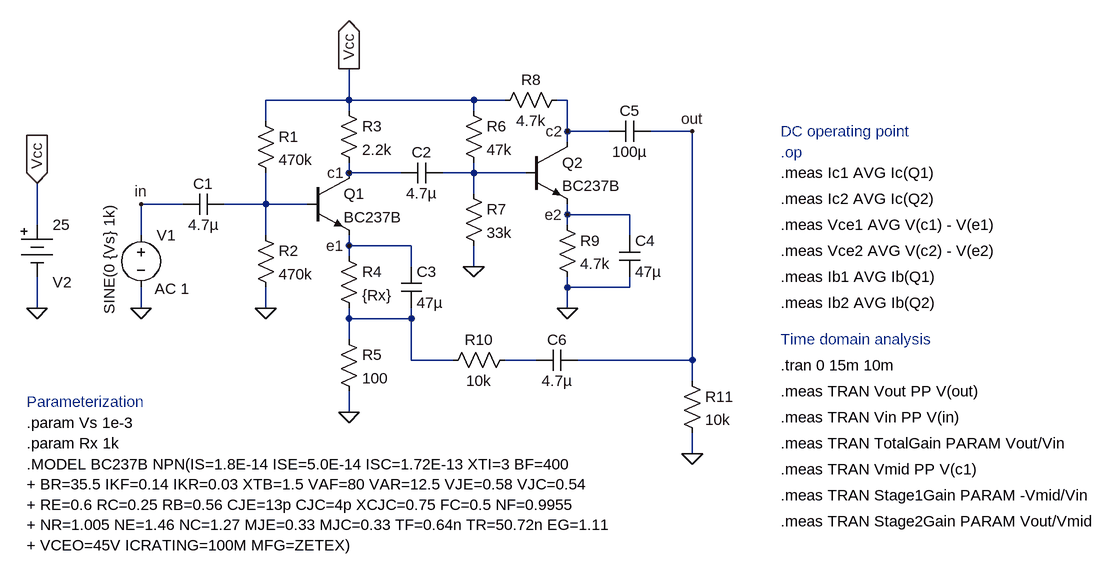
[diagram p0: schematic exp1.asc]
exp1.asc, the LTspice schematic file:
Version 4.1
SHEET 1 3584 680
WIRE 240 -80 240 -128
WIRE 240 -80 112 -80
WIRE 432 -80 240 -80
WIRE 480 -80 432 -80
WIRE 576 -80 560 -80
WIRE 240 -64 240 -80
WIRE 432 -64 432 -80
WIRE 112 -48 112 -80
WIRE 576 -32 576 -80
WIRE 640 -32 576 -32
WIRE 768 -32 704 -32
WIRE 576 -16 576 -32
WIRE 240 32 240 16
WIRE 320 32 240 32
WIRE 432 32 432 16
WIRE 432 32 384 32
WIRE 512 32 432 32
WIRE 432 64 432 32
WIRE -16 80 -80 80
WIRE 112 80 112 32
WIRE 112 80 48 80
WIRE 176 80 112 80
WIRE 576 96 576 80
WIRE 672 96 576 96
WIRE -240 112 -240 48
WIRE 576 112 576 96
WIRE -80 128 -80 80
WIRE 112 128 112 80
WIRE 672 128 672 96
WIRE 240 144 240 128
WIRE 336 144 240 144
WIRE 240 160 240 144
WIRE 336 176 336 144
WIRE 432 176 432 144
WIRE 576 208 576 192
WIRE 672 208 672 192
WIRE 672 208 576 208
WIRE -240 240 -240 192
WIRE -80 240 -80 208
WIRE 112 240 112 208
WIRE 576 240 576 208
WIRE 240 256 240 240
WIRE 336 256 336 240
WIRE 336 256 240 256
WIRE 240 288 240 256
WIRE 336 320 336 256
WIRE 400 320 336 320
WIRE 528 320 480 320
WIRE 768 320 768 -32
WIRE 768 320 592 320
WIRE 768 352 768 320
WIRE 240 400 240 368
WIRE 768 464 768 432
FLAG -80 240 0
FLAG 112 240 0
FLAG -240 240 0
FLAG -240 48 Vcc
IOPIN -240 48 In
FLAG 240 -128 Vcc
IOPIN 240 -128 Out
FLAG 240 400 0
FLAG 432 176 0
FLAG 576 240 0
FLAG 768 464 0
FLAG 240 144 e1
FLAG 240 32 c1
FLAG 576 96 e2
FLAG 576 -32 c2
FLAG -80 80 in
FLAG 768 -32 out
SYMBOL voltage -80 112 R0
WINDOW 3 -49 138 VLeft 2
WINDOW 123 21 98 Left 2
WINDOW 39 0 0 Left 0
SYMATTR InstName V1
SYMATTR Value SINE(0 {Vs} 1k)
SYMATTR Value2 AC 1
SYMBOL cap 48 64 R90
WINDOW 0 0 32 VBottom 2
WINDOW 3 32 32 VTop 2
SYMATTR InstName C1
SYMATTR Value 4.7µ
SYMBOL res 96 -64 R0
SYMATTR InstName R1
SYMATTR Value 470k
SYMBOL res 96 112 R0
SYMATTR InstName R2
SYMATTR Value 470k
SYMBOL Misc\\battery -240 96 R0
WINDOW 0 24 104 Left 2
WINDOW 3 24 16 Left 2
WINDOW 123 0 0 Left 0
WINDOW 39 0 0 Left 0
SYMATTR InstName V2
SYMATTR Value 25
SYMBOL res 224 -80 R0
SYMATTR InstName R3
SYMATTR Value 2.2k
SYMBOL npn 176 32 R0
SYMATTR InstName Q1
SYMATTR Value BC237B
SYMBOL cap 384 16 R90
WINDOW 0 0 32 VBottom 2
WINDOW 3 32 32 VTop 2
SYMATTR InstName C2
SYMATTR Value 4.7µ
SYMBOL res 224 144 R0
SYMATTR InstName R4
SYMATTR Value {Rx}
SYMBOL cap 320 176 R0
SYMATTR InstName C3
SYMATTR Value 47µ
SYMBOL res 224 272 R0
SYMATTR InstName R5
SYMATTR Value 100
SYMBOL res 416 -80 R0
SYMATTR InstName R6
SYMATTR Value 47k
SYMBOL res 416 48 R0
SYMATTR InstName R7
SYMATTR Value 33k
SYMBOL npn 512 -16 R0
SYMATTR InstName Q2
SYMATTR Value BC237B
SYMBOL res 576 -96 R90
WINDOW 0 0 56 VBottom 2
WINDOW 3 32 56 VTop 2
SYMATTR InstName R8
SYMATTR Value 4.7k
SYMBOL res 560 96 R0
SYMATTR InstName R9
SYMATTR Value 4.7k
SYMBOL cap 656 128 R0
SYMATTR InstName C4
SYMATTR Value 47µ
SYMBOL cap 704 -48 R90
WINDOW 0 0 32 VBottom 2
WINDOW 3 32 32 VTop 2
SYMATTR InstName C5
SYMATTR Value 100µ
SYMBOL res 496 304 R90
WINDOW 0 0 56 VBottom 2
WINDOW 3 32 56 VTop 2
SYMATTR InstName R10
SYMATTR Value 10k
SYMBOL cap 592 304 R90
WINDOW 0 0 32 VBottom 2
WINDOW 3 32 32 VTop 2
SYMATTR InstName C6
SYMATTR Value 4.7µ
SYMBOL res 752 336 R0
SYMATTR InstName R11
SYMATTR Value 10k
TEXT -256 480 Left 2 !.MODEL BC237B NPN(IS=1.8E-14 ISE=5.0E-14 ISC=1.72E-13 XTI=3 BF=400 \n+ BR=35.5 IKF=0.14 IKR=0.03 XTB=1.5 VAF=80 VAR=12.5 VJE=0.58 VJC=0.54 \n+ RE=0.6 RC=0.25 RB=0.56 CJE=13p CJC=4p XCJC=0.75 FC=0.5 NF=0.9955 \n+ NR=1.005 NE=1.46 NC=1.27 MJE=0.33 MJC=0.33 TF=0.64n TR=50.72n EG=1.11 \n+ VCEO=45V ICRATING=100M MFG=ZETEX)
TEXT 904 0 Left 2 ;.op
TEXT 904 32 Left 2 !.meas Ic1 AVG Ic(Q1)
TEXT 904 72 Left 2 !.meas Ic2 AVG Ic(Q2)
TEXT 904 112 Left 2 !.meas Vce1 AVG V(c1) - V(e1)
TEXT 904 152 Left 2 !.meas Vce2 AVG V(c2) - V(e2)
TEXT 904 -32 Left 2 ;DC operating point
TEXT 904 288 Left 2 ;Time domain analysis
TEXT 904 192 Left 2 !.meas Ib1 AVG Ib(Q1)
TEXT 904 232 Left 2 !.meas Ib2 AVG Ib(Q2)
TEXT 904 328 Left 2 !.tran 0 15m 10m
TEXT -256 416 Left 2 !.param Vs 1e-3
TEXT -256 448 Left 2 !.param Rx 1k
TEXT -256 384 Left 2 ;Parameterization
TEXT 904 368 Left 2 !.meas TRAN Vout PP V(out)
TEXT 904 408 Left 2 !.meas TRAN Vin PP V(in)
TEXT 904 448 Left 2 !.meas TRAN TotalGain PARAM Vout/Vin
TEXT 904 488 Left 2 !.meas TRAN Vmid PP V(c1)
TEXT 904 528 Left 2 !.meas TRAN Stage1Gain PARAM -Vmid/Vin
TEXT 904 568 Left 2 !.meas TRAN Stage2Gain PARAM Vout/Vmid

The netlist it stands for:
* exp1.asc
V1 in 0 SINE(0 {Vs} 1k) AC 1
C1 N002 in 4.7µ
R1 Vcc N002 470k
R2 N002 0 470k
V2 Vcc 0 25
R3 Vcc c1 2.2k
Q1 c1 N002 e1 0 BC237B
C2 N001 c1 4.7µ
R4 e1 N003 {Rx}
C3 e1 N003 47µ
R5 N003 0 100
R6 Vcc N001 47k
R7 N001 0 33k
Q2 c2 N001 e2 0 BC237B
R8 c2 Vcc 4.7k
R9 e2 0 4.7k
C4 e2 0 47µ
C5 out c2 100µ
R10 N004 N003 10k
C6 out N004 4.7µ
R11 out 0 10k
.model NPN NPN
.model PNP PNP
.lib standard.bjt
.MODEL BC237B NPN(IS=1.8E-14 ISE=5.0E-14 ISC=1.72E-13 XTI=3 BF=400
+ BR=35.5 IKF=0.14 IKR=0.03 XTB=1.5 VAF=80 VAR=12.5 VJE=0.58 VJC=0.54
+ RE=0.6 RC=0.25 RB=0.56 CJE=13p CJC=4p XCJC=0.75 FC=0.5 NF=0.9955
+ NR=1.005 NE=1.46 NC=1.27 MJE=0.33 MJC=0.33 TF=0.64n TR=50.72n EG=1.11
+ VCEO=45V ICRATING=100M MFG=ZETEX)
* .op
.meas Ic1 AVG Ic(Q1)
.meas Ic2 AVG Ic(Q2)
.meas Vce1 AVG V(c1) - V(e1)
.meas Vce2 AVG V(c2) - V(e2)
* DC operating point
* Time domain analysis
.meas Ib1 AVG Ib(Q1)
.meas Ib2 AVG Ib(Q2)
.tran 0 15m 10m
.param Vs 1e-3
.param Rx 1k
* Parameterization
.meas TRAN Vout PP V(out)
.meas TRAN Vin PP V(in)
.meas TRAN TotalGain PARAM Vout/Vin
.meas TRAN Vmid PP V(c1)
.meas TRAN Stage1Gain PARAM -Vmid/Vin
.meas TRAN Stage2Gain PARAM Vout/Vmid
.backanno
.end